# Altium project LCR_-------.PrjPcb
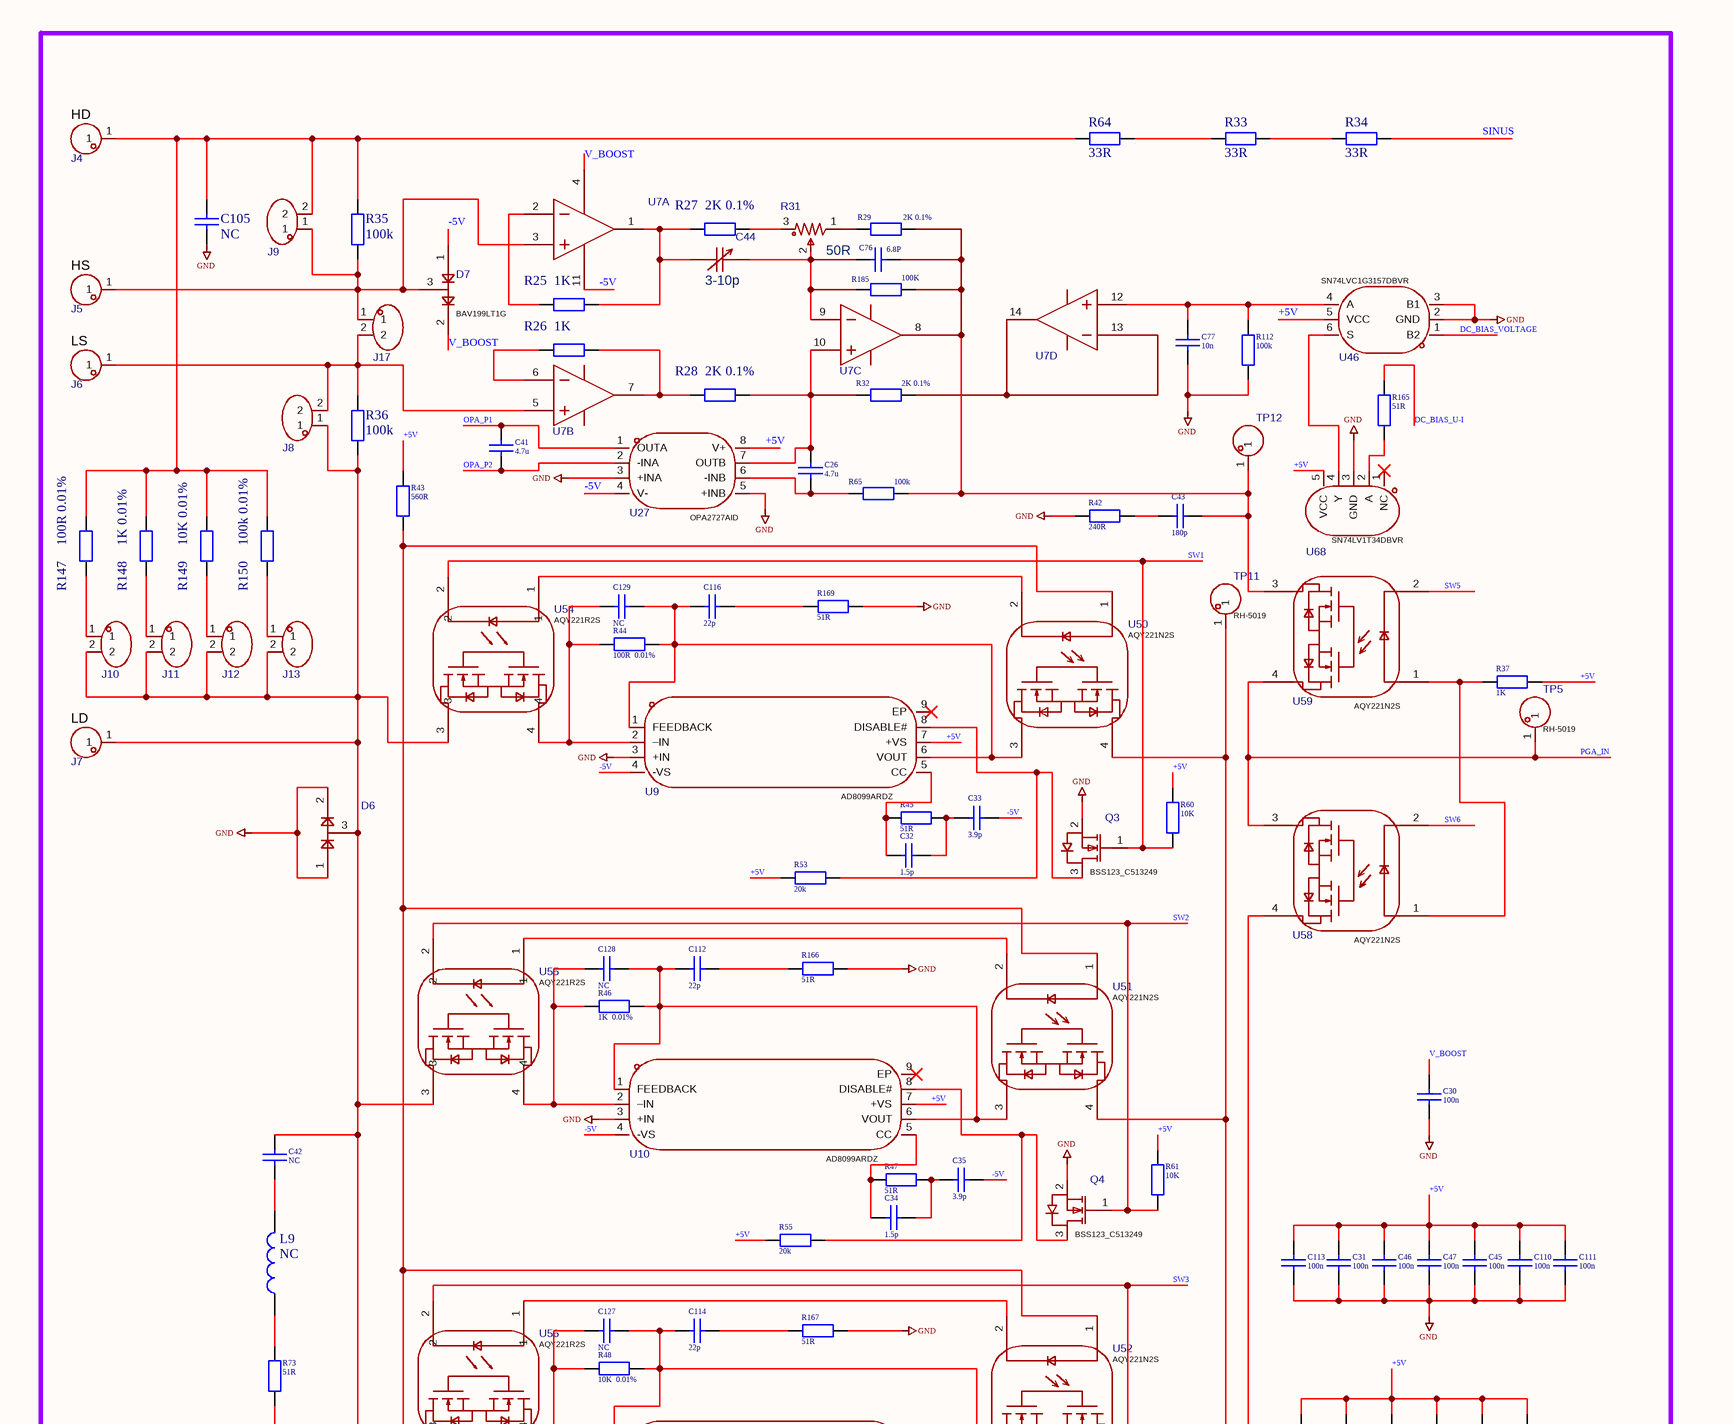
[diagram p0: LCR-----------Sheet.SchDoc, top column 1 of 4]
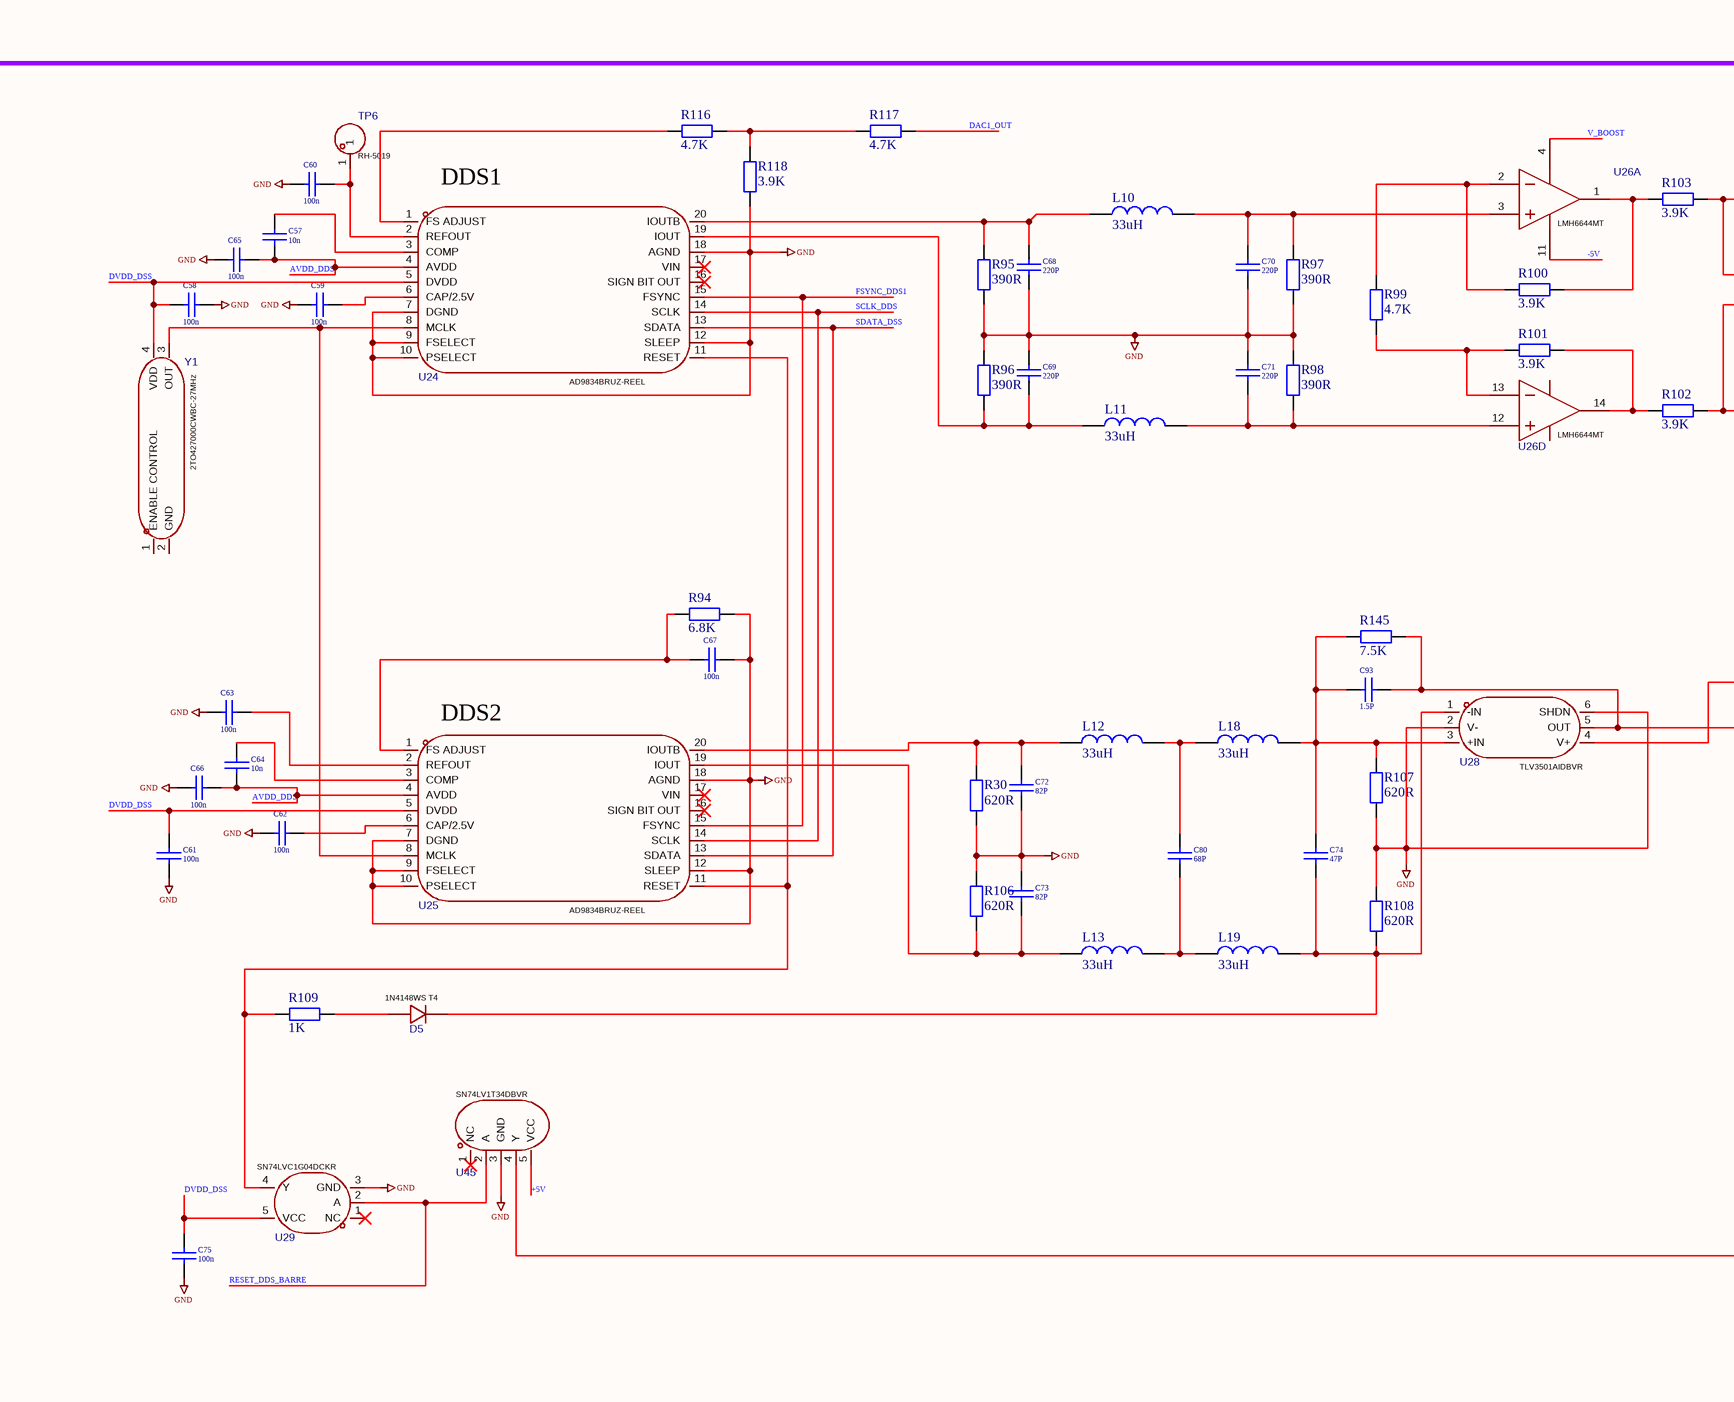
[diagram p1: LCR-----------Sheet.SchDoc, top column 2 of 4]
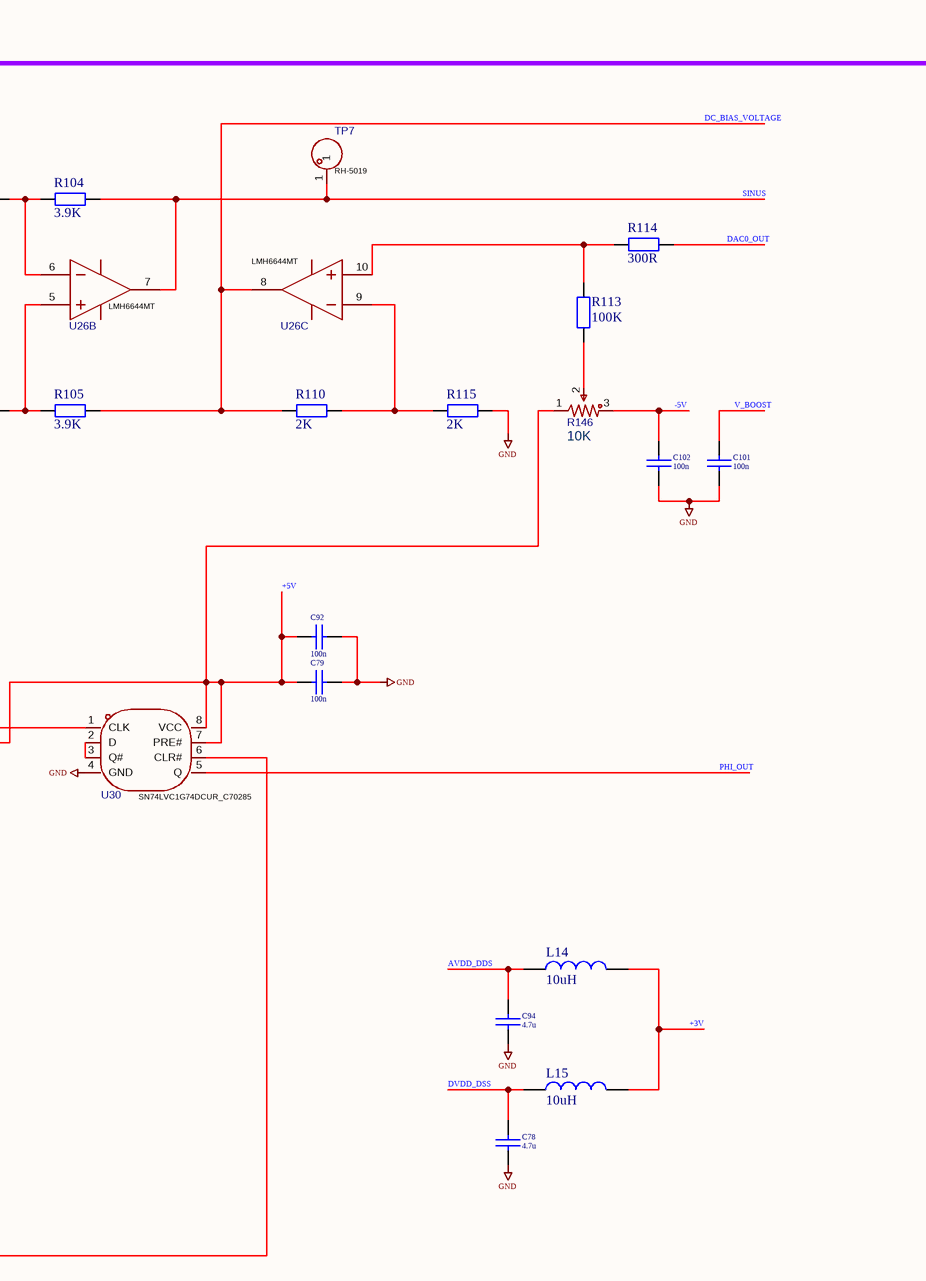
[diagram p2: LCR-----------Sheet.SchDoc, top column 3 of 4]
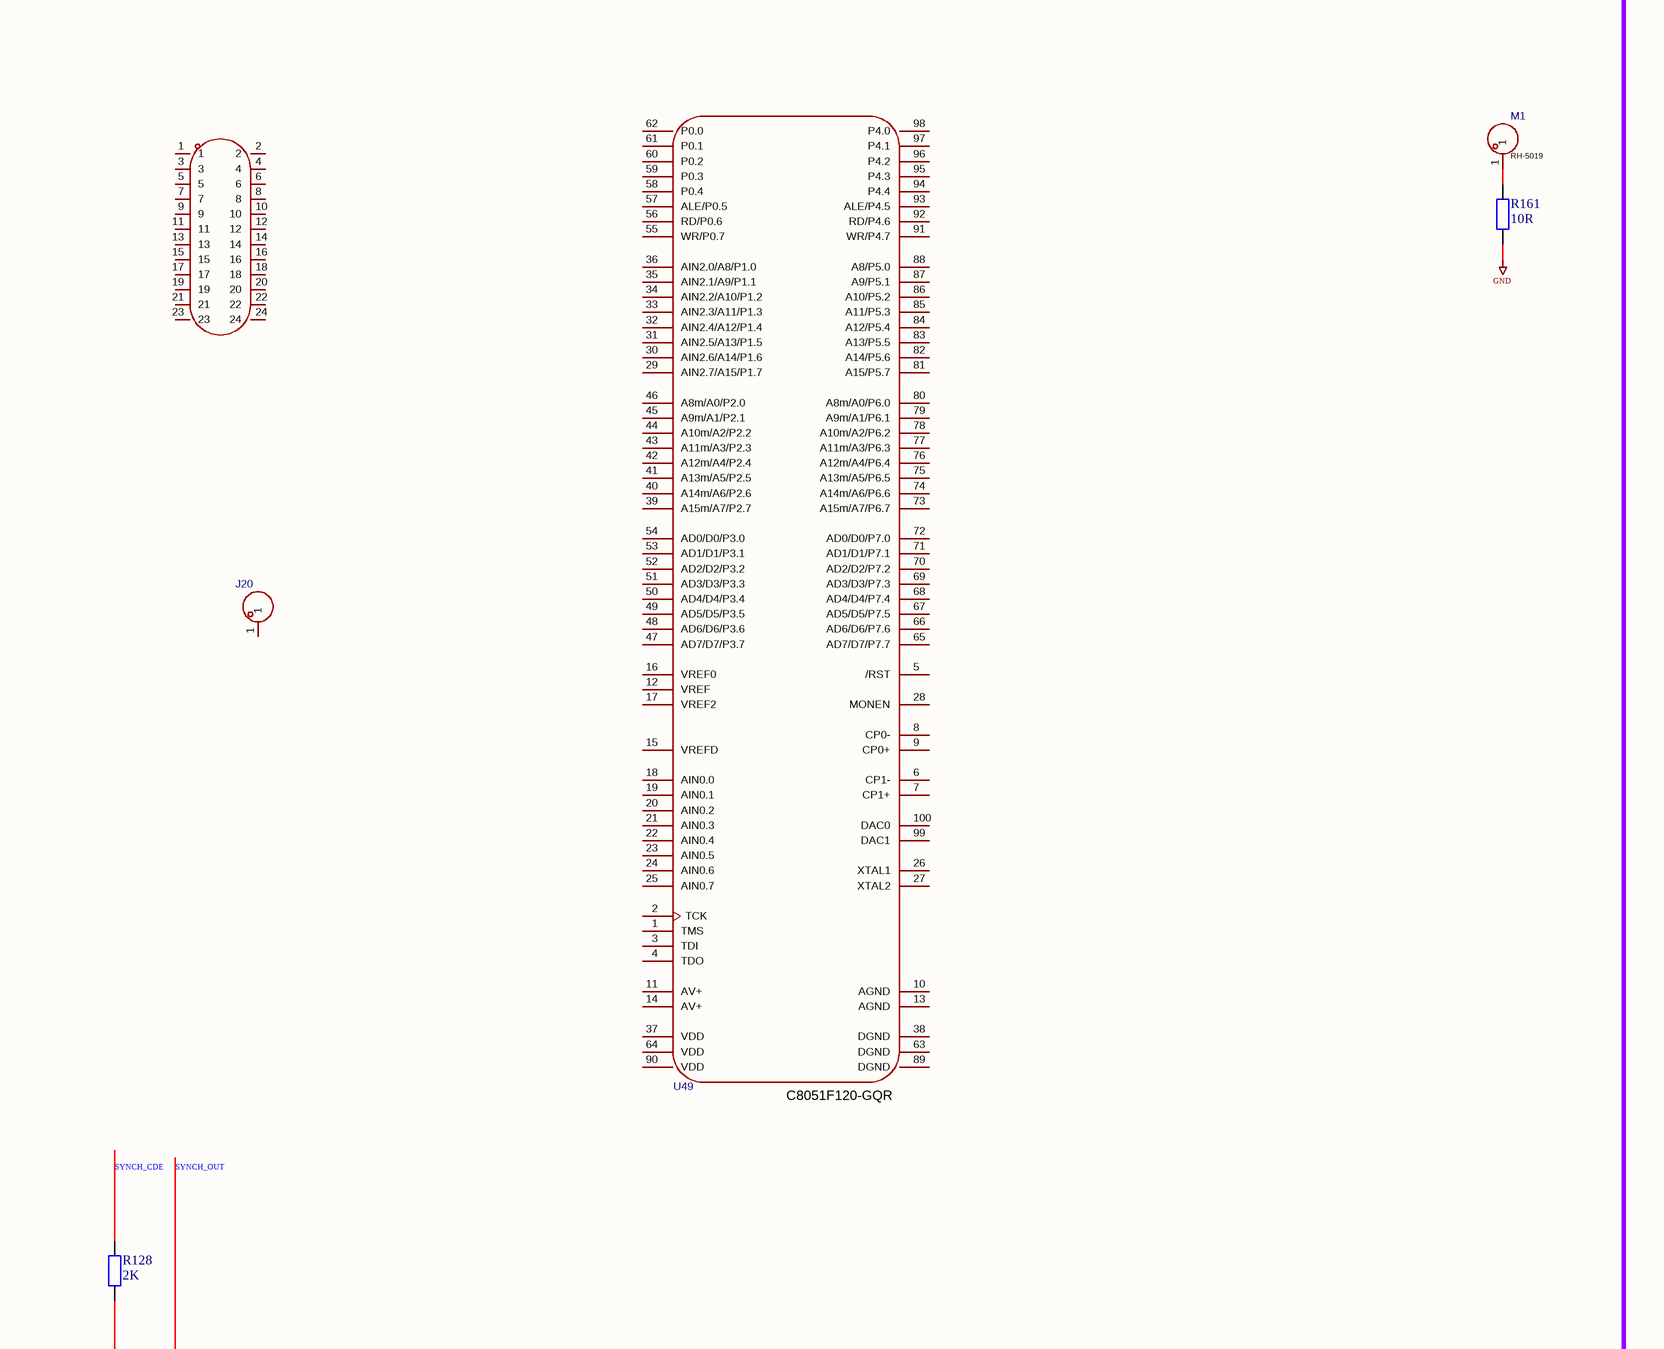
[diagram p3: LCR-----------Sheet.SchDoc, top column 4 of 4]
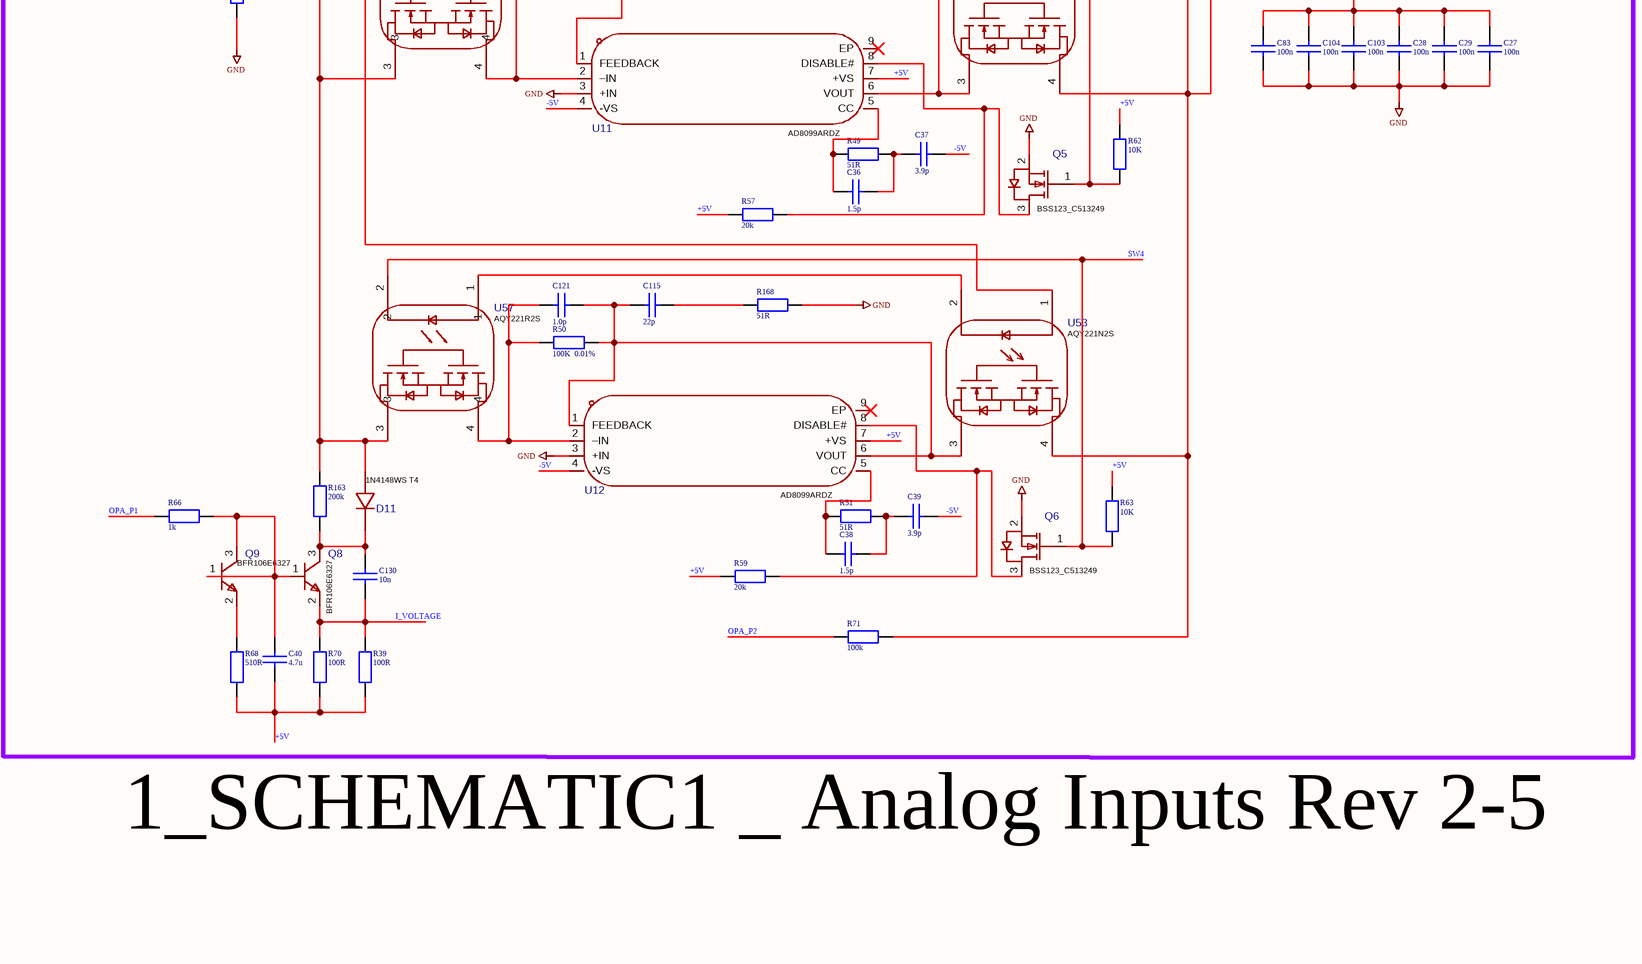
[diagram p4: LCR-----------Sheet.SchDoc, centre column 1 of 4]
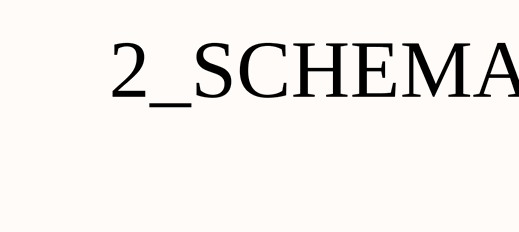
[diagram p5: LCR-----------Sheet.SchDoc, centre column 2 of 4]
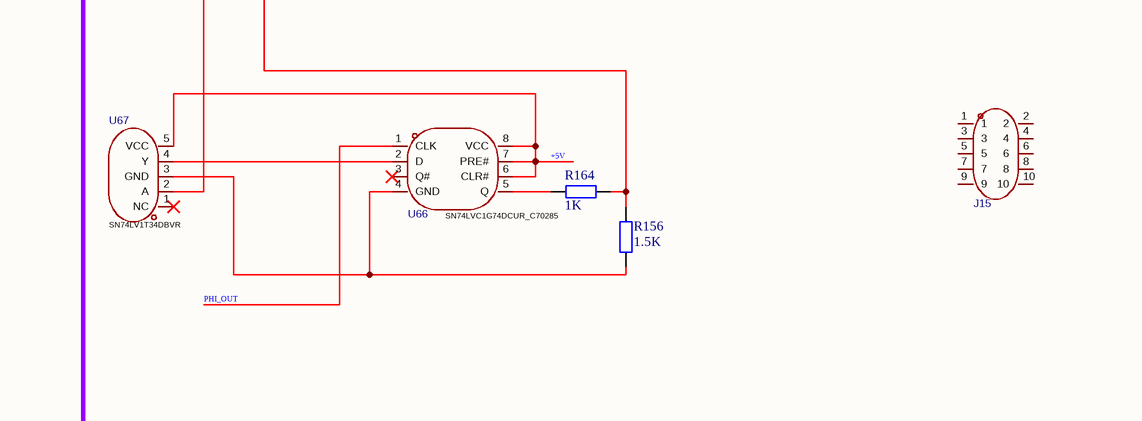
[diagram p6: LCR-----------Sheet.SchDoc, centre column 4 of 4]
1 sheet, 215 parts. Net scope: global (net labels, ports and power ports of the same name join across sheets).
Board file: LCR-------------PCB.PcbDoc

## Sheet LCR-----------Sheet.SchDoc
size 1499 x 1499 mm

### Parts
C26  4.7u  [C0603_L]
C27  100n  [C0603_L]
C28  100n  [C0603_L]
C29  100n  [C0603_L]
C30  100n  [C0603_L]
C31  100n  [C0603_L]
C32  1.5p  [C0603_L]
C33  3.9p  [C0603_L]
C34  1.5p  [C0603_L]
C35  3.9p  [C0603_L]
C36  1.5p  [C0603_L]
C37  3.9p  [C0603_L]
C38  1.5p  [C0603_L]
C39  3.9p  [C0603_L]
C40  4.7u  [C0603_L]
C41  4.7u  [C0603_L]
C42  NC  [C0603_L]
C43  180p  [C0603_L]
C44  3-10p  [CAP-SMD_L4.5-W3.2_STC3MD20-T1-cccccc]
C45  100n  [C0603_L]
C46  100n  [C0603_L]
C47  100n  [C0603_L]
C57  10n  [C0603_L]
C58  100n  [C0603_L]
C59  100n  [C0603_L]
C60  100n  [C0603_L]
C61  100n  [C0603_L]
C62  100n  [C0603_L]
C63  100n  [C0603_L]
C64  10n  [C0603_L]
C65  100n  [C0603_L]
C66  100n  [C0603_L]
C67  100n  [C0603_L]
C68  220P  [C0603_L]
C69  220P  [C0603_L]
C70  220P  [C0603_L]
C71  220P  [C0603_L]
C72  82P  [C0603_L]
C73  82P  [C0603_L]
C74  47P  [C0603_L]
C75  100n  [C0603_L]
C76  6.8P  [C0603_L]
C77  10n  [C0603_L]
C78  4.7u  [C0603_L]
C79  100n  [C0603_L]
C80  68P  [C0603_L]
C83  100n  [C0603_L]
C92  100n  [C0603_L]
C93  1.5P  [C0603_L]
C94  4.7u  [C0603_L]
C101  100n  [C0603_L]
C102  100n  [C0603_L]
C103  100n  [C0603_L]
C104  100n  [C0603_L]
C105  NC  [C0603_L]
C110  100n  [C0603_L]
C111  100n  [C0603_L]
C112  22p  [C0603_L]
C113  100n  [C0603_L]
C114  22p  [C0603_L]
C115  22p  [C0603_L]
C116  22p  [C0603_L]
C121  1.0p  [C0603_L]
C127  NC  [C0603_L]
C128  NC  [C0603_L]
C129  NC  [C0603_L]
C130  10n  [C0603_L]
D5  1N4148WS T4  [SOD-323_L1.8-W1.3-LS2.5-RD]
D6  BAV199LT1G  [SOT-23_L2.9-W1.3-P1.90-LS2.4-BR]  (value not drawn)
D7  BAV199LT1G  [SOT-23_L2.9-W1.3-P1.90-LS2.4-BR]
D11  1N4148WS T4  [SOD-323_L1.8-W1.3-LS2.5-RD]
J4  HD  [HDR-TH_1P-V-F-1]
J5  HS  [HDR-TH_1P-V-F-1]
J6  LS  [HDR-TH_1P-V-F-1]
J7  LD  [HDR-TH_1P-V-F-1]
J8  HX PZ2.54-1X2P ZZ  [HDR-TH_2P-P2.54-V-M-3]  (value not drawn)
J9  HX PZ2.54-1X2P ZZ  [HDR-TH_2P-P2.54-V-M-3]  (value not drawn)
J10  HX PZ2.54-1X2P ZZ  [HDR-TH_2P-P2.54-V-M-3]  (value not drawn)
J11  HX PZ2.54-1X2P ZZ  [HDR-TH_2P-P2.54-V-M-3]  (value not drawn)
J12  HX PZ2.54-1X2P ZZ  [HDR-TH_2P-P2.54-V-M-3]  (value not drawn)
J13  HX PZ2.54-1X2P ZZ  [HDR-TH_2P-P2.54-V-M-3]  (value not drawn)
J15  HX PM1.27-2X5P ZC  [HDR-TH_10P-P1.27-V-F-R2-C5-S1.27]  (value not drawn)
J17  HX PZ2.54-1X2P ZZ  [HDR-TH_2P-P2.54-V-M-3]  (value not drawn)
J20  X5511FV-01-C30D97-0970  [HDR-TH_1P-V-F-1]  (value not drawn)
J?  PM254-2-12-Z-8.5  [HDR-TH_24P-P2.54-V-F-R2-C12-S2.54-2]  (value not drawn)
L9  NC  [L0603]
L10  33uH  [L0603]
L11  33uH  [L0603]
L12  33uH  [L0603]
L13  33uH  [L0603]
L14  10uH  [L0603]
L15  10uH  [L0603]
L18  33uH  [L0603]
L19  33uH  [L0603]
M1  RH-5019  [TESTPOINT-SMD_L3.8-W2.0_RH-5019]
Q3  BSS123_C513249  [SOT-23-3_L2.9-W1.3-P1.90-LS2.4-BR]
Q4  BSS123_C513249  [SOT-23-3_L2.9-W1.3-P1.90-LS2.4-BR]
Q5  BSS123_C513249  [SOT-23-3_L2.9-W1.3-P1.90-LS2.4-BR]
Q6  BSS123_C513249  [SOT-23-3_L2.9-W1.3-P1.90-LS2.4-BR]
Q8  BFR106E6327  [SOT-23_L2.9-W1.3-P1.90-LS2.4-BR]
Q9  BFR106E6327  [SOT-23_L2.9-W1.3-P1.90-LS2.4-BR]
R25  1K  [R0603_L]
R26  1K  [R0603_L]
R27  2K 0.1%  [R0603_L]
R28  2K 0.1%  [R0603_L]
R29  2K 0.1%  [R0603_L]
R30  620R  [R0603_L]
R31  50R  [RES-ADJ-SMD_3313J-1-RRRRRR]
R32  2K 0.1%  [R0603_L]
R33  33R  [R0603_L]
R34  33R  [R0603_L]
R35  100k  [R0603_L]
R36  100k  [R0603_L]
R37  1K  [R0603_L]
R39  100R  [R0603_L]
R42  240R  [R0603_L]
R43  560R  [R0603_L]
R44  100R  0.01%  [R0603_L]
R45  51R  [R0603_L]
R46  1K  0.01%  [R0603_L]
R47  51R  [R0603_L]
R48  10K  0.01%  [R0603_L]
R49  51R  [R0603_L]
R50  100K  0.01%  [R0603_L]
R51  51R  [R0603_L]
R53  20k  [R0603_L]
R55  20k  [R0603_L]
R57  20k  [R0603_L]
R59  20k  [R0603_L]
R60  10K  [R0603_L]
R61  10K  [R0603_L]
R62  10K  [R0603_L]
R63  10K  [R0603_L]
R64  33R  [R0603_L]
R65  100k  [R0603_L]
R66  1k  [R0603_L]
R68  510R  [R0603_L]
R70  100R  [R0603_L]
R71  100k  [R0603_L]
R73  51R  [R0603_L]
R94  6.8K  [R0603_L]
R95  390R  [R0603_L]
R96  390R  [R0603_L]
R97  390R  [R0603_L]
R98  390R  [R0603_L]
R99  4.7K  [R0603_L]
R100  3.9K  [R0603_L]
R101  3.9K  [R0603_L]
R102  3.9K  [R0603_L]
R103  3.9K  [R0603_L]
R104  3.9K  [R0603_L]
R105  3.9K  [R0603_L]
R106  620R  [R0603_L]
R107  620R  [R0603_L]
R108  620R  [R0603_L]
R109  1K  [R0603_L]
R110  2K  [R0603_L]
R112  100k  [R0603_L]
R113  100K  [R0603_L]
R114  300R  [R0603_L]
R115  2K  [R0603_L]
R116  4.7K  [R0603_L]
R117  4.7K  [R0603_L]
R118  3.9K  [R0603_L]
R128  2K  [R0603_L]
R145  7.5K  [R0603_L]
R146  10K  [RES-ADJ-SMD_3313J-1-RRRRRR]
R147  100R 0.01%  [R0603_L]
R148  1K 0.01%  [R0603_L]
R149  10K 0.01%  [R0603_L]
R150  100k 0.01%  [R0603_L]
R156  1.5K  [R0603_L]
R161  10R  [R0603_L]
R163  200k  [R0603_L]
R164  1K  [R0603_L]
R165  51R  [R0603_L]
R166  51R  [R0603_L]
R167  51R  [R0603_L]
R168  51R  [R0603_L]
R169  51R  [R0603_L]
R185  100K  [R0603_L]
TP5  RH-5019  [TESTPOINT-SMD_L3.8-W2.0_RH-5019]
TP6  RH-5019  [TESTPOINT-SMD_L3.8-W2.0_RH-5019]
TP7  RH-5019  [TESTPOINT-SMD_L3.8-W2.0_RH-5019]
TP11  RH-5019  [TESTPOINT-SMD_L3.8-W2.0_RH-5019]
TP12  RH-5019  [TESTPOINT-SMD_L3.8-W2.0_RH-5019]  (value not drawn)
U7  LMH6644MT  [TSSOP-14_L5.0-W4.4-P0.65-LS6.4-BL]  (value not drawn)  (parts A,B,C,D of 4)
U9  AD8099ARDZ  [SOIC-8_L4.9-W3.9-P1.27-LS6.0-BL-EP]
U10  AD8099ARDZ  [SOIC-8_L4.9-W3.9-P1.27-LS6.0-BL-EP]
U11  AD8099ARDZ  [SOIC-8_L4.9-W3.9-P1.27-LS6.0-BL-EP]
U12  AD8099ARDZ  [SOIC-8_L4.9-W3.9-P1.27-LS6.0-BL-EP]
U24  AD9834BRUZ-REEL  [TSSOP-20_L6.5-W4.4-P0.65-LS6.4-BL]
U25  AD9834BRUZ-REEL  [TSSOP-20_L6.5-W4.4-P0.65-LS6.4-BL]
U26  LMH6644MT  [TSSOP-14_L5.0-W4.4-P0.65-LS6.4-BL]  (parts A,B,C,D of 4)
U27  OPA2727AID  [SOIC-8_L4.9-W3.9-P1.27-LS6.0-BL]
U28  TLV3501AIDBVR  [SOT-23-6_L2.9-W1.6-P0.95-LS2.8-BR]
U29  SN74LVC1G04DCKR  [SOT-353_L2.1-W1.3-P0.65-LS2.3-BR]
U30  SN74LVC1G74DCUR_C70285  [SSOP-8_L2.0-W2.3-P0.50-LS3.1-BR]
U45  SN74LV1T34DBVR  [SOT-23-5_L2.9-W1.6-P0.95-LS2.8-BR]
U46  SN74LVC1G3157DBVR  [SOT-23-6_L2.9-W1.6-P0.95-LS2.8-BR]
U49  C8051F120-GQR  [TQFP-100_L14.0-W14.0-P0.50-LS16.0-BL]
U50  AQY221N2S  [SOP-4_L4.3-W4.4-P2.54-LS7.0-BL]
U51  AQY221N2S  [SOP-4_L4.3-W4.4-P2.54-LS7.0-BL]
U52  AQY221N2S  [SOP-4_L4.3-W4.4-P2.54-LS7.0-BL]
U53  AQY221N2S  [SOP-4_L4.3-W4.4-P2.54-LS7.0-BL]
U54  AQY221R2S  [SOP-4_L4.4-W4.3-P2.54-LS6.8-BL]
U55  AQY221R2S  [SOP-4_L4.4-W4.3-P2.54-LS6.8-BL]
U56  AQY221R2S  [SOP-4_L4.4-W4.3-P2.54-LS6.8-BL]
U57  AQY221R2S  [SOP-4_L4.4-W4.3-P2.54-LS6.8-BL]
U58  AQY221N2S  [SOP-4_L4.3-W4.4-P2.54-LS7.0-BL]
U59  AQY221N2S  [SOP-4_L4.3-W4.4-P2.54-LS7.0-BL]
U66  SN74LVC1G74DCUR_C70285  [SSOP-8_L2.0-W2.3-P0.50-LS3.1-BR]
U67  SN74LV1T34DBVR  [SOT-23-5_L2.9-W1.6-P0.95-LS2.8-BR]
U68  SN74LV1T34DBVR  [SOT-23-5_L2.9-W1.6-P0.95-LS2.8-BR]
Y1  2TO427000CWBC-27MHz  [OSC-SMD_4P-L2.5-W2.0-BL-27MHz]

### Nets
GND: C27.1 C28.1 C29.1 C30.1 C31.1 C45.1 C46.1 C47.1 C58.2 C59.1 C60.1 C61.1 C62.1 C63.1 C65.1 C66.1 C67.2 C68.1 C69.2 C70.1 C71.2 C72.1 C73.2 C75.1 C77.2 C78.1 C79.1 C83.1 C92.1 C94.1 C101.1 C102.1 C103.1 C104.1 C105.1 C110.1 C111.1 C113.1 D6.1(A) D6.2(C) Q3.2(S) Q4.2(S) Q5.2(S) Q6.2(S) R30.1 R42.1 R73.1 R94.2 R95.1 R96.2 R97.1 R98.2 R106.2 R107.1 R108.2 R112.2 R115.1 R118.2 R161.2 R166.2 R167.2 R168.2 R169.2 U9.3(+IN) U10.3(+IN) U11.3(+IN) U12.3(+IN) U24.7(DGND) U24.9(FSELECT) U24.10(PSELECT) U24.12(SLEEP) U24.18(AGND) U25.7(DGND) U25.9(FSELECT) U25.10(PSELECT) U25.12(SLEEP) U25.18(AGND) U27.3(+INA) U27.5(+INB) U28.2(V-) U28.6(SHDN) U29.3(GND) U30.4(GND) U45.3(GND) U46.2(GND) U46.3(B1) U68.3(GND)
+3V: L14.2 L15.2
+5V: C27.2 C28.2 C29.2 C31.2 C40.1 C45.2 C46.2 C47.2 C79.2 C83.2 C92.2 C103.2 C104.2 C110.2 C111.2 C113.2 R37.2 R39.1 R43.2 R53.1 R55.1 R57.1 R59.1 R60.2 R61.2 R62.2 R63.2 R68.1 R70.1 R146.1 U9.7(+VS) U10.7(+VS) U11.7(+VS) U12.7(+VS) U27.8(V+) U28.4(V+) U30.7(PRE#) U30.8(VCC) U45.5(VCC) U46.5(VCC) U66.6(CLR#) U66.7(PRE#) U66.8(VCC) U67.5(VCC) U68.5(VCC)
-5V: C33.2 C35.2 C37.2 C39.2 C102.2 D7.1(A) R146.3 U7.11(V-) U9.4(-VS) U10.4(-VS) U11.4(-VS) U12.4(-VS) U26.11(V-) U27.4(V-)
AVDD_DDS: C57.1 C64.1 C65.2 C66.2 C94.2 L14.1 U24.4(AVDD) U25.4(AVDD)
DAC0_OUT: R114.1
DAC1_OUT: R117.2
DC_BIAS_U-I: R165.1
DC_BIAS_VOLTAGE: R105.1 R110.2 U26.8(OUTC) U46.1(B2)
DVDD_DSS: C58.1 C61.2 C75.2 C78.2 L15.1 U24.5(DVDD) U25.5(DVDD) U29.5(VCC) Y1.4(VDD)
FSYNC_DDS1: U24.15(FSYNC) U25.15(FSYNC)
I_VOLTAGE: C130.1 Q8.2(E) R39.2 R70.2
OPA_P1: C41.1 R66.1 U27.1(OUTA)
OPA_P2: C41.2 R71.1 U27.2(-INA)
PGA_IN: TP5.1 U58.3(D) U59.4(D)
PHI_OUT: U30.5(Q) U66.1(CLK)
RESET_DDS_BARRE: U29.2(A) U45.2(A)
SCLK_DDS: U24.14(SCLK) U25.14(SCLK)
SDATA_DSS: U24.13(SDATA) U25.13(SDATA)
SINUS: R34.1 R104.1 TP7.1 U26.7(OUTB)
SW1: Q3.1(G) R60.1 U54.2
SW2: Q4.1(G) R61.1 U55.2
SW3: Q5.1(G) R62.1 U56.2
SW4: Q6.1(G) R63.1 U57.2
SW5: U59.2(C)
SW6: U58.2(C)
SYNCH_CDE: R128.1
SYNCH_OUT: R156.1 R164.1
V_BOOST: C30.2 C101.2 D7.2(C) U7.4(V+) U26.4(V+)
NetC26_1: C26.1 R28.1 R32.2 U7.10(INC+) U27.7(OUTB)
NetC26_2: C26.2 R65.2 U27.6(-INB)
NetC32_1: C32.1 R45.1 U9.5(CC)
NetC32_2: C32.2 C33.1 R45.2
NetC34_1: C34.1 R47.1 U10.5(CC)
NetC34_2: C34.2 C35.1 R47.2
NetC36_1: C36.1 R49.1 U11.5(CC)
NetC36_2: C36.2 C37.1 R49.2
NetC38_1: C38.1 R51.1 U12.5(CC)
NetC38_2: C38.2 C39.1 R51.2
NetC40_2: C40.2 Q8.1(B) Q9.1(B) Q9.3(C) R66.2
NetC42_1: C42.1 L9.2
NetC42_2: C42.2 D6.3(C/A) D11.2(A) J7.1 J8.1 J10.2 J11.2 J12.2 J13.2 R36.1 R163.2 U54.3 U55.3 U56.3 U57.3
NetC43_1: C43.1 R42.2
NetC43_2: C43.2 C76.1 R29.1 R65.1 R185.1 TP12.1 U7.8(OUTC) U59.3(D)
NetC44_1: C44.1 R25.1 R27.2 U7.1(OUTA)
NetC44_2: C44.2 C76.2 R31.2 R185.2 U7.9(INC-)
NetC57_2: C57.2 U24.3(COMP)
NetC59_2: C59.2 U24.6(CAP/2.5V)
NetC60_2: C60.2 TP6.1 U24.2(REFOUT)
NetC62_2: C62.2 U25.6(CAP/2.5V)
NetC63_2: C63.2 U25.2(REFOUT)
NetC64_2: C64.2 U25.3(COMP)
NetC67_1: C67.1 R94.1 U25.1(FS_ADJUST)
NetC68_2: C68.2 L10.1 R95.2 U24.20(IOUTB)
NetC69_1: C69.1 L11.1 R96.1 U24.19(IOUT)
NetC70_2: C70.2 L10.2 R97.2 U26.3(INA+)
NetC71_1: C71.1 L11.2 R98.1 U26.12(IND+)
NetC72_2: C72.2 L12.1 R30.2 U25.20(IOUTB)
NetC73_1: C73.1 L13.1 R106.1 U25.19(IOUT)
NetC74_1: C74.1 D5.1(K) L19.2 R108.1 U28.1(-IN)
NetC74_2: C74.2 C93.2 L18.2 R107.2 R145.2 U28.3(+IN)
NetC77_1: C77.1 R112.1 U7.12(IND+) U46.4(A)
NetC80_1: C80.1 L13.2 L19.1
NetC80_2: C80.2 L12.2 L18.1
NetC93_1: C93.1 R145.1 U28.5(OUT) U30.1(CLK)
NetC105_2: C105.2 J4.1 J9.2 R35.2 R64.2 R147.2 R148.2 R149.2 R150.2
NetC112_1: C112.1 C128.2 R46.2 U10.1(FEEDBACK) U10.6(VOUT) U51.3(D)
NetC112_2: C112.2 R166.1
NetC114_1: C114.1 C127.2 R48.2 U11.1(FEEDBACK) U11.6(VOUT) U52.3(D)
NetC114_2: C114.2 R167.1
NetC115_1: C115.1 C121.2 R50.2 U12.1(FEEDBACK) U12.6(VOUT) U53.3(D)
NetC115_2: C115.2 R168.1
NetC116_1: C116.1 C129.2 R44.2 U9.1(FEEDBACK) U9.6(VOUT) U50.3(D)
NetC116_2: C116.2 R169.1
NetC121_1: C121.1 R50.1 U12.2(–IN) U57.4
NetC127_1: C127.1 R48.1 U11.2(–IN) U56.4
NetC128_1: C128.1 R46.1 U10.2(–IN) U55.4
NetC129_1: C129.1 R44.1 U9.2(–IN) U54.4
NetC130_2: C130.2 D11.1(K) Q8.3(C) R163.1
NetD5_2: D5.2(A) R109.2
NetD7_3: D7.3(C/A) J5.1 J9.1 J17.1 R35.1 U7.3(INA+)
NetJ6_1: J6.1 J8.2 J17.2 R36.2 U7.5(INB+)
NetJ10_1: J10.1 R147.1
NetJ11_1: J11.1 R148.1
NetJ12_1: J12.1 R149.1
NetJ13_1: J13.1 R150.1
NetL9_1: L9.1 R73.2
NetM1_1: M1.1 R161.1
NetQ3_3: Q3.3(D) R53.2 U9.8(DISABLE#)
NetQ4_3: Q4.3(D) R55.2 U10.8(DISABLE#)
NetQ5_3: Q5.3(D) R57.2 U11.8(DISABLE#)
NetQ6_3: Q6.3(D) R59.2 U12.8(DISABLE#)
NetQ9_2: Q9.2(E) R68.2
NetR25_2: R25.2 U7.2(INA-)
NetR26_1: R26.1 R28.2 U7.7(OUTB)
NetR26_2: R26.2 U7.6(INB-)
NetR27_1: R27.1 R31.3
NetR29_2: R29.2 R31.1
NetR32_1: R32.1 U7.13(IND-) U7.14(OUTD)
NetR33_1: R33.1 R34.2
NetR33_2: R33.2 R64.1
NetR37_1: R37.1 U58.1(A) U59.1(A)
NetR43_1: R43.1 U50.1(A) U51.1(A) U52.1(A) U53.1(A)
NetR71_2: R71.2 TP11.1 U50.4(D) U51.4(D) U52.4(D) U53.4(D) U58.4(D)
NetR99_1: R99.1 R101.2 U26.13(IND-)
NetR99_2: R99.2 R100.2 U26.2(INA-)
NetR100_1: R100.1 R103.2 U26.1(OUTA)
NetR101_1: R101.1 R102.2 U26.14(OUTD)
NetR102_1: R102.1 R105.2 U26.5(INB+)
NetR103_1: R103.1 R104.2 U26.6(INB-)
NetR109_1: R109.1 U24.11(RESET) U25.11(RESET) U29.4(Y)
NetR110_1: R110.1 R115.2 U26.9(INC-)
NetR113_1: R113.1 R114.2 U26.10(INC+)
NetR113_2: R113.2 R146.2
NetR116_1: R116.1 U24.1(FS_ADJUST)
NetR116_2: R116.2 R117.1 R118.1
NetR128_2: R128.2 U67.2(A)
NetR156_2: R156.2 U66.4(GND) U67.3(GND)
NetR164_2: R164.2 U66.5(Q)
NetR165_2: R165.2 U68.2(A)
NetU24_8: U24.8(MCLK) U25.8(MCLK) Y1.3(OUT)
NetU30_2: U30.2(D) U30.3(Q#)
NetU30_6: U30.6(CLR#) U45.4(Y)
NetU46_6: U46.6(S) U68.4(Y)
NetU50_2: U50.2(C) U54.1
NetU51_2: U51.2(C) U55.1
NetU52_2: U52.2(C) U56.1
NetU53_2: U53.2(C) U57.1
NetU66_2: U66.2(D) U67.4(Y)

Not connected (* = marked no-connect by the designer): J15 1 2 3 4 5 6 7 8 9 10; J20 1; J? 1 2 3 4 5 6 7 8 9 10 11 12 13 14 15 16 17 18 19 20 21 22 23 24; U9 9(EP)*; U10 9(EP)*; U11 9(EP)*; U12 9(EP)*; U24 16(SIGN_BIT_OUT)* 17(VIN)*; U25 16(SIGN_BIT_OUT)* 17(VIN)*; U29 1(NC)*; U45 1(NC)*; U49 1(TMS) 2(TCK) 3(TDI) 4(TDO) 5(/RST) 6(CP1-) 7(CP1+) 8(CP0-) 9(CP0+) 10(AGND) 11(AV+) 12(VREF) 13(AGND) 14(AV+) 15(VREFD) 16(VREF0) 17(VREF2) 18(AIN0.0) 19(AIN0.1) 20(AIN0.2) 21(AIN0.3) 22(AIN0.4) 23(AIN0.5) 24(AIN0.6) 25(AIN0.7) 26(XTAL1) 27(XTAL2) 28(MONEN) 29(AIN2.7/A15/P1.7) 30(AIN2.6/A14/P1.6) 31(AIN2.5/A13/P1.5) 32(AIN2.4/A12/P1.4) 33(AIN2.3/A11/P1.3) 34(AIN2.2/A10/P1.2) 35(AIN2.1/A9/P1.1) 36(AIN2.0/A8/P1.0) 37(VDD) 38(DGND) 39(A15m/A7/P2.7) 40(A14m/A6/P2.6) 41(A13m/A5/P2.5) 42(A12m/A4/P2.4) 43(A11m/A3/P2.3) 44(A10m/A2/P2.2) 45(A9m/A1/P2.1) 46(A8m/A0/P2.0) 47(AD7/D7/P3.7) 48(AD6/D6/P3.6) 49(AD5/D5/P3.5) 50(AD4/D4/P3.4) 51(AD3/D3/P3.3) 52(AD2/D2/P3.2) 53(AD1/D1/P3.1) 54(AD0/D0/P3.0) 55(WR/P0.7) 56(RD/P0.6) 57(ALE/P0.5) 58(P0.4) 59(P0.3) 60(P0.2) 61(P0.1) 62(P0.0) 63(DGND) 64(VDD) 65(AD7/D7/P7.7) 66(AD6/D6/P7.6) 67(AD5/D5/P7.5) 68(AD4/D4/P7.4) 69(AD3/D3/P7.3) 70(AD2/D2/P7.2) 71(AD1/D1/P7.1) 72(AD0/D0/P7.0) 73(A15m/A7/P6.7) 74(A14m/A6/P6.6) 75(A13m/A5/P6.5) 76(A12m/A4/P6.4) 77(A11m/A3/P6.3) 78(A10m/A2/P6.2) 79(A9m/A1/P6.1) 80(A8m/A0/P6.0) 81(A15/P5.7) 82(A14/P5.6) 83(A13/P5.5) 84(A12/P5.4) 85(A11/P5.3) 86(A10/P5.2) 87(A9/P5.1) 88(A8/P5.0) 89(DGND) 90(VDD) 91(WR/P4.7) 92(RD/P4.6) 93(ALE/P4.5) 94(P4.4) 95(P4.3) 96(P4.2) 97(P4.1) 98(P4.0) 99(DAC1) 100(DAC0); U66 3(Q#)*; U67 1(NC)*; U68 1(NC)*; Y1 1(ENABLE_CONTROL) 2(GND)

### Notes on the sheet
- (near U24) DDS1
- (near U25) DDS2
- 2_SCHEMATIC1 _ LCR6-Main Board-DDS Rev 2-1
- 1_SCHEMATIC1 _ Analog Inputs Rev 2-5

### Library data of the parts
C26-C43 C45-C47 C57-C80 C83 C92-C94 C101-C105 C110-C116 C121 C127-C130 = C: 贴片电容/MLCC电容; BOM名称: 无极性贴片电容; 当前库版本V2022.12.25 @淘宝卖家:黄晶宝石: 最新版本发布https://shop463601444.taobao.com
C44 = STC3MB10-T1-cccc: 可调节电容3P-10P; Symbol: STC3MB10-T1
J4-J7 J20 = X5511FV-01-C30D97-0970: 排母1X1; Symbol: X5511FV-01-C30D97-0970
J8-J13 J17 = HX PZ2.54-1X2P ZZ: 排针  1X2; Symbol: HX PZ2.54-1X2P ZZ
J15 = HX PM1.27-2X5P ZC: 排母  2X5; Symbol: HX PM1.27-2X5P ZC
J? = PM254-2-12-Z-8.5: 排针   2 X  12  芯片对面的; Symbol: PM254-2-12-Z-8.5
L9-L15 L18 L19 = L: 贴片小功率电感; BOM名称: 小功率贴片电感; 联系下单店铺卖家 免费帮你查找封装: 联系下单店铺卖家 免费技术支持
M1 TP5-TP7 TP11 TP12 = RH-5019: 测试点   测试环; Symbol: RH-5019
R25-R30 R32-R37 R39 R42-R51 R53 R55 R57 R59-R66 R68 R70 R71 R73 R94-R110 R112-R118 R128 R145 R147-R150 R156 R161 R163-R169 R185 = R: 贴片电阻; 联系下单店铺卖家 免费帮你查找封装: 联系下单店铺卖家 免费技术支持; BOM名称: 贴片电阻
R31 R146 = 3313J-1-500E: 可调电阻; Symbol: 3313J-1-500E
U7 U26 = LMH6644MT: Symbol: LMH6644MTX/NOPB
Y1 = 2TO427000CWBC-27MHz: 有源晶振   27MHz; Symbol: 2TO427000CWBC
D5 D11 = 1N4148WS T4: Symbol: 1N4148WS T4
D6 D7 = BAV199LT1G: Symbol: BAV199LT1G
Q3-Q6 = BSS123_C513249: Symbol: BSS123_C513249
Q8 Q9 = BFR106E6327: Symbol: BFR106E6327
U9-U12 = AD8099ARDZ: Symbol: AD8099ARDZ
U24 U25 = AD9834BRUZ-REEL: Symbol: AD9834BRUZ-REEL
U27 = OPA2727AID: Symbol: OPA2727AID
U28 = TLV3501AIDBVR: Symbol: TLV3501AIDBVR
U29 = SN74LVC1G04DCKR: Symbol: SN74LVC1G04DCKR
U30 U66 = SN74LVC1G74DCUR_C70285: Symbol: SN74LVC1G74DCUR_C70285
U45 U67 U68 = SN74LV1T34DBVR: Symbol: SN74LV1T34DBVR
U46 = SN74LVC1G3157DBVR: Symbol: SN74LVC1G3157DBVR
U49 = C8051F120-GQR: Symbol: C8051F120-GQR
U50-U53 U58 U59 = AQY221N2S: Symbol: AQY221N2S
U54-U57 = AQY221R2S: Symbol: AQY221R2S